# Altium schematic sheet POWER.SchDoc: POWER
size A4; DocumentNumber: 2; SheetNumber: 2; SheetTotal: 15
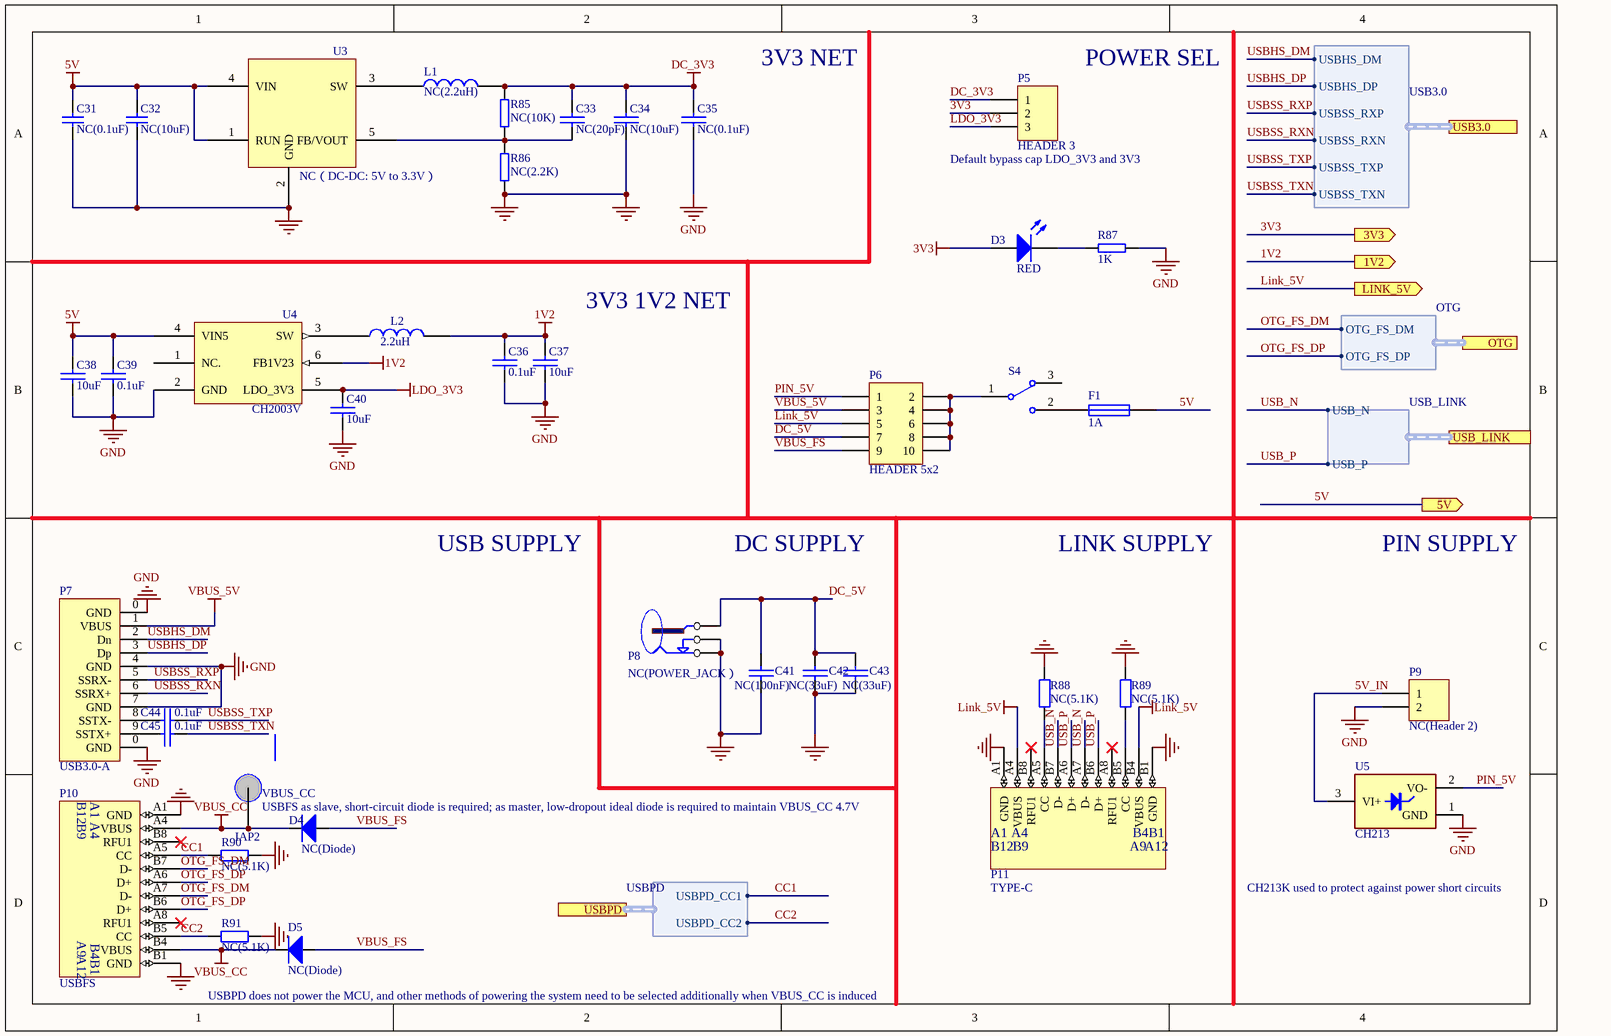
[diagram p0: POWER.SchDoc]

## Parts
C31  NC(0.1uF)  [0402_C]
C32  NC(10uF)  [0603_C]
C33  NC(20pF)  [0402_C]
C34  NC(10uF)  [0603_C]
C35  NC(0.1uF)  [0402_C]
C36  0.1uF  [0402_C]
C37  10uF  [0603_C]
C38  10uF  [0603_C]
C39  0.1uF  [0402_C]
C40  10uF  [0603_C]
C41  NC(100nF)  [0402_C]
C42  NC(33uF)  [3528_C]
C43  NC(33uF)  [3528_C]
C44  0.1uF  [0402_C]
C45  0.1uF  [0402_C]
D3  RED  [0603+]
D4  NC(Diode)  [SOD-323]
D5  NC(Diode)  [SOD-323]
F1  1A  [0805]
IAP2  VBUS_CC  [TESTPOINT1]
L1  NC(2.2uH)  [CD32]
L2  2.2uH  [CD32]
P5  HEADER 3  [SIP3-2.54MM]
P6  HEADER 5x2  [IDC10-2.54mm]
P7  USB3.0-A  [USB3.0-A-Receptacle]
P8  NC(POWER_JACK）  [DC-005]
P9  NC(Header 2)  [SIP2-2.54mm]
P10  USBFS  [TYPE-C-Receptacle-2.0]
P11  TYPE-C  [TYPE-C-Receptacle-2.0]
R85  NC(10K)  [0402]
R86  NC(2.2K)  [0402]
R87  1K  [0402]
R88  NC(5.1K)  [0402]
R89  NC(5.1K)  [0402]
R90  NC(5.1K)  [0402]
R91  NC(5.1K)  [0402]
S4  SW-SPDT  [SW1]  (value not drawn)
U3  NC（DC-DC: 5V to 3.3V）  [SOT-23-5]
U4  CH2003V  [SOT-23-6]
U5  CH213  [SOT-23-3]

## Ports
1V2 (out), 3V3 (out), 5V (out), LINK_5V (out), OTG (harness OTG), USB3.0 (harness USB3.0), USB_LINK (harness USB_LINK), USBPD (harness USBPD)

## Harnesses
USB_LINK: USB_P, USB_N
USB3.0: USBHS_DM, USBHS_DP, USBSS_RXP, USBSS_RXN, USBSS_TXP, USBSS_TXN
OTG: OTG_FS_DP, OTG_FS_DM
USBPD: USBPD_CC1, USBPD_CC2

## Nets
1V2: C36.2 C37.2 L2.2 U4.6(FB1V23) ; port 1V2
3V3: D3.1(A) P5.2 ; port 3V3
5V: C31.2 C32.2 C38.2 C39.2 F1.1 U3.1(RUN) U3.4(VIN) U4.4(VIN5) ; port 5V
DC_3V3: C33.1 C34.1 C35.1 L1.2 P5.1 R85.1
GND: C31.1 C32.1 C34.2 C35.2 C36.1 C37.1 C38.1 C39.1 C40.1 C41.1 C42.1 C43.1 P7.0(GND) P7.4(GND) P7.7(GND) P8.2(G) P8.3(X) P9.2 P10.A1(GND) P10.B1(GND) P11.A1(GND) P11.B1(GND) R86.1 R87.2 R88.2 R89.2 R90.2 R91.2 U3.2(GND) U4.2(GND) U5.1(GND)
LDO_3V3: C40.2 P5.3 U4.5(LDO_3V3)
Link_5V: P6.5 P11.A4(VBUS) P11.B4(VBUS) ; port LINK_5V
VBUS_5V: P6.3 P7.1(VBUS)
VBUS_CC: D4.2(K) D5.2(K) IAP2.1(point) P10.A4(VBUS) P10.B4(VBUS)
5V_IN: P9.1 U5.3(VI+)
CC1: P10.A5(CC) R90.1 ; port USBPD.USBPD_CC1
CC2: P10.B5(CC) R91.1 ; port USBPD.USBPD_CC2
DC_5V: C41.2 C42.2 C43.2 P6.7 P8.1(V)
OTG_FS_DM: P10.A7(D-) P10.B7(D-) ; port OTG.OTG_FS_DM
OTG_FS_DP: P10.A6(D+) P10.B6(D+) ; port OTG.OTG_FS_DP
PIN_5V: P6.1 U5.2(VO-)
USB_N: P11.A7(D-) P11.B7(D-) ; port USB_LINK.USB_N
USB_P: P11.A6(D+) P11.B6(D+) ; port USB_LINK.USB_P
USBHS_DM: P7.2(Dn) ; port USB3.0.USBHS_DM
USBHS_DP: P7.3(Dp) ; port USB3.0.USBHS_DP
USBSS_RXN: P7.6(SSRX+) ; port USB3.0.USBSS_RXN
USBSS_RXP: P7.5(SSRX-) ; port USB3.0.USBSS_RXP
USBSS_TXN: C45.2 ; port USB3.0.USBSS_TXN
USBSS_TXP: C44.2 ; port USB3.0.USBSS_TXP
VBUS_FS: D4.1(A) D5.1(A) P6.9
NetC33_2: C33.2 R85.2 R86.2 U3.5(FB/VOUT)
NetC44_1: C44.1 P7.8(SSTX-)
NetC45_1: C45.1 P7.9(SSTX+)
NetD3_2: D3.2(K) R87.1
NetF1_2: F1.2 S4.2
NetL1_1: L1.1 U3.3(SW)
NetL2_1: L2.1 U4.3(SW)
NetP6_2: P6.2 P6.4 P6.6 P6.8 P6.10 S4.1
NetP11_A5: P11.A5(CC) R88.1
NetP11_B5: P11.B5(CC) R89.1

Not connected (* = marked no-connect by the designer): P10 A8(RFU1)* B8(RFU1)*; P11 A8(RFU1)* B8(RFU1)*; S4 3; U4 1(NC.)

## Notes on the sheet
- (near U3) Hot!!!
- 3V3 NET
- POWER SEL
- (near P5) Default bypass cap LDO_3V3 and 3V3
- 3V3 1V2 NET
- USB SUPPLY
- DC SUPPLY
- LINK SUPPLY
- PIN SUPPLY
- USBFS as slave, short-circuit diode is required; as master, low-dropout ideal diode is required to maintain VBUS_CC 4.7V
- CH213K used to protect against power short circuits
- USBPD does not power the MCU, and other methods of powering the system need to be selected additionally when VBUS_CC is induced
- (in symbol TYPE-C1) B12; B9; A9; A12

## Library data of the parts
C31 C32 = Cap: Capacitor; Published: 8-Jun-2000; LatestRevisionDate: 17-Jul-2002; LatestRevisionNote: Re-released for DXP Platform.; PackageReference: RAD-0.3; Publisher: Altium Limited; PackageDescription: Radial Cap, Thru-Hole; 2 Leads; 0.3 in Pin Spacing
C33-C45 = CAP: Capacitor
  C41: 容值: 100nF
  C42 C43: 容值: 33uF
D3 = LED0: Typical INFRARED GaAs LED; Published: 8-Jun-2000; LatestRevisionDate: 08-Jul-2005; LatestRevisionNote: Mech Layer 1 removed.; PackageReference: LED-0; Publisher: Altium Limited; PackageDescription: LED; 2 Leads
D4 D5 = Diode: Default Diode
F1 = FUSE1: Fuse
IAP2 = Testpoint: 测试点
L1 L2 = INDUCTOR
P5 = HEADER 3: Header, 3-Pin
P6 = HEADER 5x2: Header, 5-Pin, Dual row
P8 = POWER_JACK
P9 = Header 2: Header, 2-Pin; Publisher: Altium Limited
P10 P11 = TYPE-C1
R85 R86 = R
R87 = RES
R88-R91 = Res2: Resistor
S4 = SW-SPDT: SPDT Subminiature Toggle Switch, Right Angle Mounting, Vertical Actuation
U3 = 8503AM
U4 = CH2003V: Step-Down DC-DC Converter, 5V input, 1.23V * 700mA output, with LDO 3.3V * 160mA
U5 = CH213E: Ideal Diode 5V*1A